# EAGLE design fuente_dual_power (EAGLE 9.4.2)
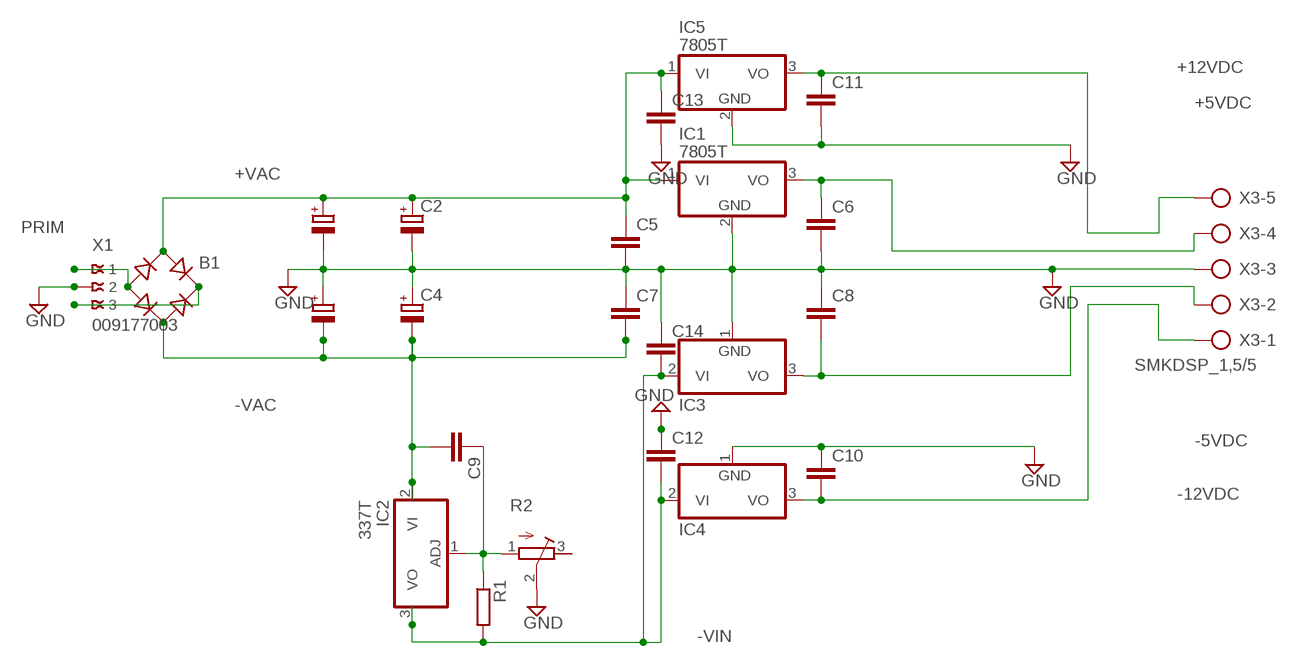
[diagram p0: schematic, sheet 1]

## Parts
B1  RB1A  [RB1A]
C2  CPOL-EUE1.8-4  [E1,8-4]
C4  CPOL-EUE1.8-4  [E1,8-4]
C5  C5/7.2  [C5B7.2]
C6  C5/7.2  [C5B7.2]
C7  C5/7.2  [C5B7.2]
C8  C5/7.2  [C5B7.2]
C9  C5/7.2  [C5B7.2]
C10  C5/7.2  [C5B7.2]
C11  C5/7.2  [C5B7.2]
C12  C5/7.2  [C5B7.2]
C13  C5/7.2  [C5B7.2]
C14  C5/7.2  [C5B7.2]
IC1  7805T  [TO220H]
IC2  337T  [TO220H]
IC3  7905T  [TO220H]
IC4  7905T  [TO220H]
IC5  7805T  [TO220H]
R1  R-EU_0204/5  [0204/5]
R2  R-TRIMM64W  [RTRIM64W]
X1  009177003  [009177003]
X3  SMKDSP_1,5/5  [SMKDSP_1,5/5]

## Nets
+5VDC: C6.1 IC1.3(VO) X3.4
+12VDC: C11.1 IC5.3(VO) X3.5
+VAC: B1.AC1 C2.+ C5.1 C13.1 IC1.1(VI) IC5.1(VI)
-5VDC: C8.2 IC3.3(VO) X3.2
-12VDC: C10.2 IC4.3(VO) X3.1
-VAC: B1.AC2 C4.- C7.2 C9.2 IC2.2(VI)
-VIN: C12.2 C14.2 IC2.3(VO) IC3.2(VI) IC4.2(VI) R1.2
ADJ: C9.1 IC2.1(ADJ) R1.1 R2.1(A)
GND: C2.- C4.+ C5.2 C6.2 C7.1 C8.1 C10.1 C11.2 C12.1 C13.2 C14.1 IC1.2(GND) IC3.1(GND) IC4.1(GND) IC5.2(GND) R2.2(S) X1.2 X3.3
PRIM: B1.- X1.1
SEC: B1.+ X1.3
Unconnected: R2.3(E)

## Library data of the parts
B1 = rectifier:RB1A: RECTIFIER 1 A
C2 C4 = rcl:CPOL-EU: POLARIZED CAPACITOR, European symbol; SPICEPREFIX: C
C5-C7 C9 C12-C14 = capacitor-wima:C: CAPACITOR naming: grid - package width
C8 C10 C11 = capacitor-wima:C: CAPACITOR naming: grid - package width; SPICEPREFIX: C
IC1 IC5 = linear:78*: Positive VOLTAGE REGULATOR Source: http://cache.national.com/ds/LM/LM78L05.pdf http://www.fairchildsemi.com/ds/LM/LM7805.pdf
IC2 = linear:*337: Negative VOLTAGE REGULATOR
IC3 IC4 = linear:79*: Negative VOLTAGE REGULATOR
R1 = rcl:R-EU_: RESISTOR, European symbol; SPICEPREFIX: R
R2 = rcl:R-TRIMM: Trimm resistor; SPICEMODEL: X; SPICEPREFIXL: POT
X1 = con-avx:00917?003: Wire to Board Strip IDC Connector 3 WAY Source: http://www.avx.com/docs/Catalogs/9176.pdf http://www.avx.com/docs/Catalogs/9177.pdf; MPN: 009177003001006; OC_FARNELL: unknown; OC_NEWARK: 09P1128
X3 = con-phoenix-smkdsp:SMKDSP_1,5/5: Printklemme, Nennstrom: 17,5 A, Bemessungsspannung: 250 V, Raster: 5,0 mm Source: http://eshop.phoenixcontact.de .. 1733415.pdf; OC_FARNELL: unknown; OC_NEWARK: unknown

## Board
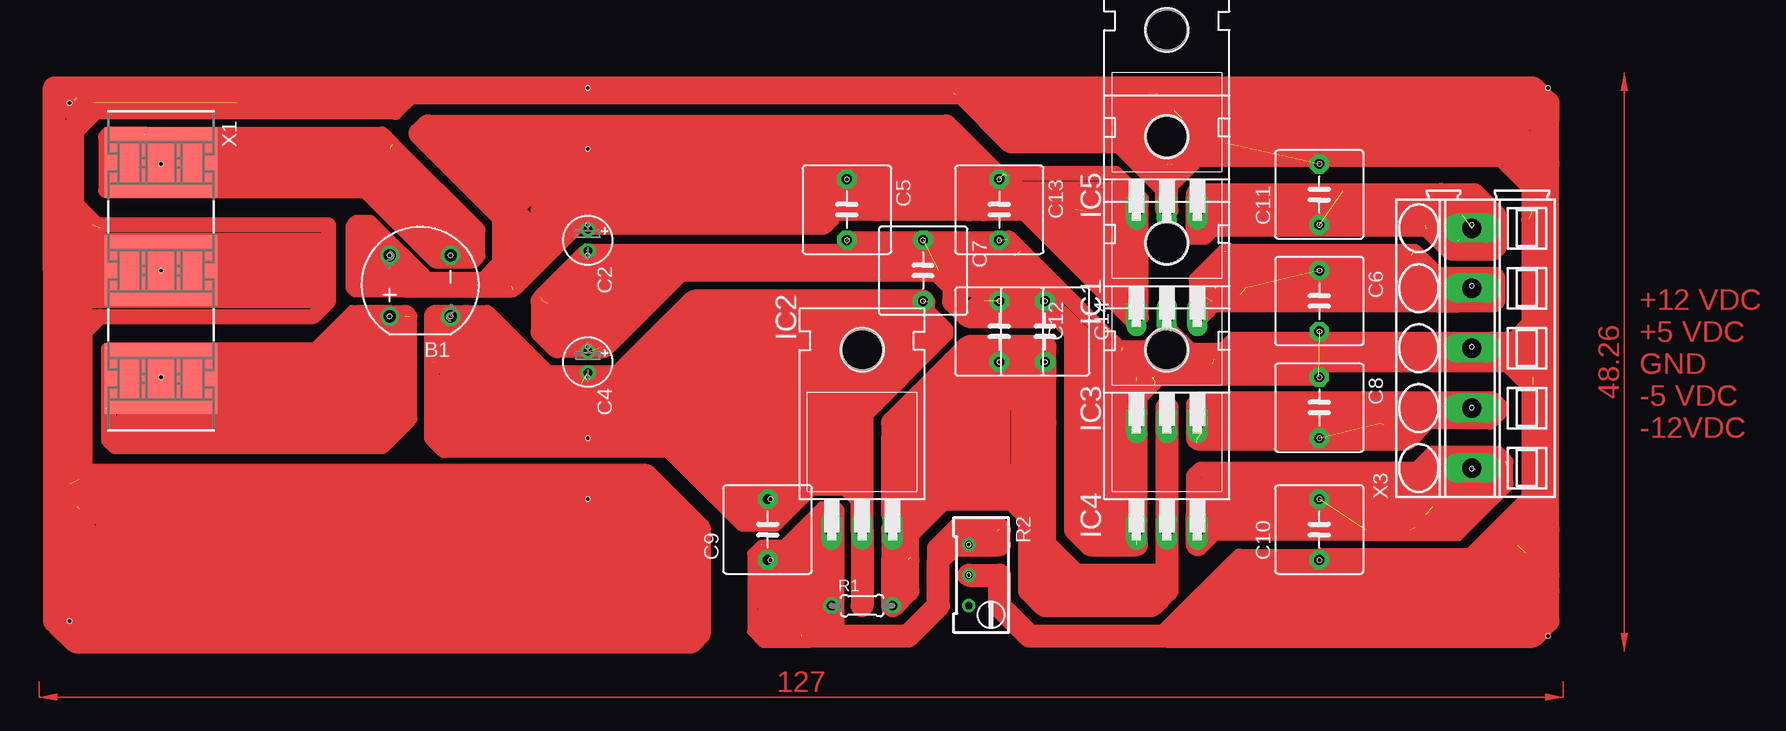
[diagram p1: board, top side]

No outline drawn. Coordinates in mm, seen from the top.
Copper layers (1*16): Top 0.035mm / dielectric 1.5mm / Bottom 0.035mm
Design rules "default": minimum track width 6mil, minimum drill 0.35mm, track to track 6mil, track to pad 6mil, pad to pad 6mil, via to via 6mil, smd to smd 6mil, copper to edge 40mil, drill to drill 6mil, minimum pad ring 10mil, minimum via ring 8mil, stop-mask expansion 4mil, vias tented up to drill 0mil, thermal gap 10mil
Holes 0.35 mm at 115.57,33.02 115.57,38.1 115.57,27.94 115.57,22.86 115.57,17.78 102.87,10.16 102.87,15.24 102.87,20.32 102.87,25.4 102.87,29.21 102.87,38.1 92.71,12.7 90.17,12.7 87.63,12.7 87.63,21.59 90.17,21.59 92.71,21.59 87.63,30.48 90.17,30.48 92.71,30.48 87.63,39.37 90.17,39.37 92.71,39.37 102.87,43.18 102.87,34.29 73.66,8.89 73.66,11.43 67.31,6.35 62.23,6.35 62.23,12.7 64.77,12.7 67.31,12.7 57.15,15.24 57.15,10.16 80.01,26.67 80.01,31.75 76.2,31.75 76.2,26.67 69.85,31.75 69.85,36.83 76.2,36.83 63.5,36.83 76.2,41.91 63.5,41.91 41.91,38.1 41.91,35.56 41.91,27.94 41.91,25.4 41.91,20.32 41.91,15.24 41.91,44.45 41.91,49.53 30.48,30.48 30.48,35.56 25.4,35.56 25.4,30.48 6.35,25.4 6.35,34.29 6.35,43.18 -1.27,5.08 -1.27,48.26 121.92,49.53 121.92,3.81

### Footprints (pad centres in the part's own frame; a part is rotated, then mirrored left to right if it is on the bottom)
RB1A = drill 1.016: + -2.54,2.54 | drill 1.016 octagon: - 2.54,-2.54; AC1 2.54,2.54; AC2 -2.54,-2.54
E1,8-4 = drill 0.711 pad 1.168: + -0.889,0 | drill 0.711 pad 1.168 octagon: - 0.889,0
C5B7.2 = drill 0.813 pad 1.6 octagon: 1 -2.54,0; 2 2.54,0
TO220H = drill 1.118 long: 1 -2.54,-10.16; 2 0,-10.16; 3 2.54,-10.16 | hole 3.302: 0,4.826
0204/5 = drill 0.813 octagon: 1 -2.54,0; 2 2.54,0
RTRIM64W = drill 0.61: 1 1.27,-2.54; 2 1.27,0; 3 1.27,2.54
009177003 = smd 5.9 x 9.4: 1 -9,0; 2 0,0; 3 9,0
SMKDSP_1,5/5 = drill 1.6 pad 1.8 long: 1 -2.5,0; 2 2.5,0; 3 7.5,0; 4 12.5,0; 5 17.5,0

### Placement (x,y rotation side)
B1  27.94,33.02 90 top
C2  41.91,36.83 270 top
C4  41.91,26.67 270 top
C5  63.5,39.37 270 top
C6  102.87,31.75 270 top
C7  69.85,34.29 270 top
C8  102.87,22.86 270 top
C9  56.9,12.7 90 top
C10  102.87,12.7 90 top
C11  102.87,40.64 90 top
C12  76.2,29.21 270 top
C13  76.2,39.37 270 top
C14  80.01,29.21 270 top
IC1  90.17,40.64 0 top
IC2  64.77,22.86 0 top
IC3  90.17,31.75 0 top
IC4  90.17,22.86 0 top
IC5  90.17,49.53 0 top
R1  64.77,6.35 0 top
R2  74.93,8.89 180 top
X1  6.35,34.29 270 top
X3  115.57,20.32 90 top

### Tracks (layer width: path | path; a pad name or v marks a point on that pad's centre or on a via)
+5VDC  (7 unrouted)
  Top 1.27: 111.71,33.98 117.53,33.98 117.73,33.78 117.73,31.7 117.45,31.42 94.23,31.42 93.93,31.73 | 95.07,35.92 110.8,35.92 112.45,34.27 96.01,34.27 95.96,34.31 96.52,34.87 110.52,34.87 | 95.71,35.79 95.58,35.92 94.97,35.92 92.61,33.55 92.61,29.97 94.87,32.23 96.01,32.23 | 96.24,32.23 96.01,32.23 | 96.01,32.23 95.28,32.97 94.31,32.97 93.37,32.03
  Top 1.905: 111.76,32.82 X3.4 115.57,33.02 | 111.76,32.82 96.72,32.82 96.52,33.02 | 94.18,32.82 93.98,33.02 95.89,34.92 | 110.49,35.56 113.03,33.02 | 111.76,32.82 112.83,31.75 114.3,31.75
+12VDC  (6 unrouted)
  Top 1.27: 114.58,36.83 113.03,36.83 111.76,38.1 | 92.73,40.72 92.33,40.31 92.33,37.08 93.34,37.08 94.13,37.87 | 110.39,38.25 110.87,37.77 111.78,37.77 113.79,35.76 117.45,35.76 | 117.81,36.12 117.81,38.91 116.53,38.91 115.44,40.01 114.58,40.01 112.85,38.28 114.38,36.75 116.97,36.75 114.78,38.94 114.78,39.04 | 104.85,40.95 115.88,40.95 117.81,39.01
  Top 1.905: IC5.3 93.98,38.1 111.76,38.1 | 113.03,40.64 92.71,40.64 IC5.3 | IC5.3 113.03,39.37
+VAC  (7 unrouted)
  Top 1.27: C2.+ 42.29,38.1 46.99,38.1 48.26,39.37 | 28.8,33.25 23.75,38.3 22.63,38.3 22.33,38 22.33,32.92 22.55,32.69 35.69,32.69 34.85,33.53 22.58,33.53 | 41.88,37.92 61.65,37.92 62.26,38.53 | 78.16,40.46 87.55,31.06 87.61,31.06 87.61,40.21 87.58,40.23 78.77,40.23 76.83,42.16 | 83.44,39.19 83.64,39.4 86.59,39.4 | 77.93,39.45 87.25,30.12 87.76,30.12 88.04,30.4 88.04,40.26 85.9,42.39 76.58,42.39 77.85,41.12 86.92,41.12
  Top 1.778: 26.04,34.92 27.94,33.02 29.21,33.02 33.02,33.02 34.92,34.92 35.56,35.56 36.83,36.83 37.47,37.47 38.1,38.1 38.1,39.37 38.1,41.91 38.1,44.45 39.37,45.72 43.18,45.72 48.26,45.72 49.53,45.72
  Top 1.905: C13.1 74.3,43.81 | 74.3,43.81 73.66,44.45 | 73.66,44.45 73.03,45.09 | 73.03,45.09 72.39,45.72 | 72.39,45.72 48.26,45.72 30.48,45.72 | C13.1 73.66,39.37 66.04,39.37 C5.1 60.96,44.45 44.45,44.45 43.18,45.72 | C13.1 78.74,39.37 | 82.55,35.56 82.55,38.1 | 82.55,38.1 82.55,39.37 78.74,39.37 | 86.58,38.1 83.82,38.1 83.82,35.56 82.55,35.56 | 78.74,39.37 49.53,39.37 45.72,43.18 | 38.1,38.1 40.64,38.1 38.1,35.56 | 34.92,34.92 34.92,38.73 | 34.92,38.73 38.1,41.91 | 35.56,35.56 38.1,35.56 | 38.1,35.56 35.56,33.02 29.21,33.02 26.67,33.02 26.04,33.66 26.04,34.92 25.4,34.29 22.86,34.29 22.86,36.83 24.13,36.83 24.77,36.2 | B1.AC1 24.77,36.2 | 24.77,36.2 24.13,35.56 | 72.39,45.72 71.75,46.35 28.57,46.35 27.94,45.72 31.75,41.91 | 34.92,38.73 32.38,41.27 | 32.38,41.27 31.75,41.91 | 30.48,45.72 30.48,44.45 | 73.03,45.09 31.11,45.09 | 31.11,45.09 30.48,45.72 | 31.11,45.09 31.75,44.45 73.66,44.45 | 74.3,43.81 73.66,43.18 31.75,43.18 31.75,41.91 | 32.38,41.27 75.56,41.27 | 75.56,41.27 C13.1 | C13.1 76.2,40.64 74.93,39.37 | 34.92,38.73 36.83,36.83 | 37.47,37.47 34.29,40.64 | 75.56,41.27 74.93,41.91 73.66,41.91 | 86.58,38.1 86.55,38.08 86.55,35.08 86.58,35.05 86.58,33.23 86.36,33.02 84.45,34.92 | 84.45,34.92 84.45,36.2 85.09,36.83 | 84.45,34.92 85.09,35.56 | 78.74,39.37 79.38,38.73 | 79.38,38.73 82.55,35.56 | 79.38,38.73 81.92,38.73 82.55,38.1 | 38.1,39.37 48.26,39.37 59.69,39.37 60.96,40.64 | 87.63,39.16 86.58,38.1
-5VDC  (4 unrouted)
  Top 1.27: 110.92,21.72 110.64,21.44 108.28,21.44 | 92.66,19.94 110.26,19.94 112.01,21.69 117.04,21.69 117.09,21.64 117.96,22.5 117.96,22.96 117.32,23.6 92.84,23.6 92.41,23.16 | 93.04,20.7 93.12,20.78 110.31,20.78
  Top 1.905: IC3.3 92.71,22.86 95.25,22.86 95.29,22.82 X3.2 | IC3.3 92.71,20.32 | IC3.3 107.95,21.59
-12VDC  (6 unrouted)
  Top 0.635: 110.45,12.7 113.03,12.7 113.67,13.34 | 113.67,13.34 116.84,16.51 116.84,16.55 | 111.11,13.36 113.64,13.36 113.67,13.34 | X3.1 116.84,16.55 | 116.84,16.55 115.61,16.55 115.57,16.51
  Top 0.813: 118.52,18.06 118.52,16.2 114.45,12.14 110.13,12.14 110.87,12.88 114.15,12.88 117.83,16.56 117.88,16.56 117.91,16.59 117.91,18.14 117.32,17.55 117.32,16.74
  Top 1.27: X3.1 115.57,16.51 113.03,13.97 | 111.76,13.97 95.25,13.97 | 115.85,17.7 92.89,17.7 92.38,17.2 92.38,11.43 93.52,12.57 93.52,16.61 93.83,16.92 108.97,16.92 107.92,15.88 94.13,15.88 | 118.42,16.54 118.42,18.36 117.73,19.05 112.34,19.05 111.15,17.86
  Top 1.905: 92.71,13.97 92.71,11.43 93.98,12.7 106.68,12.7 | X3.1 115.53,17.78 111.76,17.78 110.49,16.51 106.68,12.7 | X3.1 112.38,14.62 | 112.38,14.62 111.11,13.36 110.45,12.7 106.68,12.7 | 112.38,14.62 94.64,14.62 93.98,13.97 | X3.1 112.99,15.24 111.76,15.24 111.76,16.51 113.03,16.51
-VAC  (5 unrouted)
  Top 1.27: 51.79,19.28 29.92,19.28 28.91,20.3 28.91,26.72 33.02,26.72 39.42,20.32 30.1,20.32 30.07,20.34 30.07,25.27 32.84,25.27 32.92,25.35 37.11,21.16 | 37.11,21.16 37.39,21.16 | 37.11,21.16 31.11,21.16 30.91,21.36 30.91,24.23 32.72,24.23 32.74,24.26 35.15,21.84 | 35.15,21.84 35.31,21.84 | 35.15,21.84 31.98,21.84 31.77,22.05 31.77,23.16 33.17,23.16 33.58,22.76 33.43,22.61 32.61,22.61 | 48.44,19.51 54.79,13.16 57.53,13.16 60.63,16.26 60.63,16.41 59.74,16.41 57.15,13.82 54.86,13.82 54.79,13.89 | 29.72,27.18 29.72,30.12 30.4,30.81 33.53,30.81 38.61,25.73 | 64.69,21.92 71.75,28.98 71.75,29.36 70.26,30.86 | 70.26,30.86 70.26,31.7 | 70.26,30.86 70.26,29.36 70.61,29.01
  Top 1.778: 31.75,30.48 33.02,30.48 34.29,29.21 35.56,27.94
  Top 1.905: 36.83,26.67 35.56,27.94 | 38.1,25.4 34.29,29.21 34.29,27.94 31.75,27.94 31.11,28.57 | 38.1,22.86 38.1,25.4 | 66.81,30.77 66.27,31.3 56.71,31.3 | 66.81,30.77 68.39,29.18 68.39,26.19 | 66.81,30.77 C7.2 | 64.77,15.24 IC2.2 64.77,6.35 | 64.77,15.24 64.77,22.57 66.27,24.07 | 49.53,20.32 49.53,19.05 50.8,17.78 | 49.53,20.32 40.64,20.32 38.1,22.86 | C9.2 53.34,15.24 50.8,17.78 | 31.75,30.48 B1.AC2 29.21,30.48 29.21,26.67 30.48,26.67 | 30.48,26.67 34.29,26.67 38.1,22.86 | 63.5,16.51 64.77,15.24 | C9.2 57.66,16 | 57.66,16 58.17,16.51 59.69,16.51 | 59.69,16.51 63.5,16.51 | 59.69,16.51 58.42,15.24 C9.2 | 68.39,26.19 69.85,27.65 C7.2 | C7.2 50.8,31.75 50.16,31.11 | 39.37,25.4 44.45,25.4 46.99,27.94 | 39.37,25.4 38.1,25.4 | 50.16,31.11 47.62,28.57 | 47.62,28.57 46.99,27.94 | 39.37,25.4 39.37,22.86 40.64,21.59 63.5,21.59 63.5,22.86 41.91,22.86 40.64,24.13 41.27,24.77 41.97,24.07 66.27,24.07 | 66.27,24.07 68.39,26.19 | 49.53,20.32 63.5,20.32 63.5,19.05 50.8,19.05 50.8,17.78 | 50.8,17.78 63.5,17.78 63.5,16.51 | 57.66,16 53.85,16 45.72,24.13 45.72,25.4 61.94,25.4 | 61.94,25.4 62.08,25.25 | 61.94,25.4 60.67,26.67 46.99,26.67 46.99,27.94 | 47.62,28.57 60.33,28.57 60.96,27.94 61.15,28.13 61.15,29.18 62.34,30.37 62.23,30.48 60.96,30.48 | 60.96,30.48 59.69,29.21 49.53,29.21 | 50.16,31.11 60.33,31.11 60.96,30.48 | 30.48,26.67 31.11,27.3 29.84,28.57 30.48,29.21 31.11,28.57 | 31.11,28.57 31.75,29.21 33.02,29.21
  Top 2.54: 61.94,25.4 64.77,25.4 66.67,27.3 | 66.67,27.3 67.31,27.94 65.41,29.84 62.23,26.67 62.87,26.04 64.14,26.04 66.04,27.94 66.67,27.3 | 61.15,29.18 61.17,29.21 68.58,29.21
-VIN  (2 unrouted)
  Top 1.27: 79.15,12.93 77.22,14.86 71.53,14.86 68.83,12.17 68.83,10.39
  Top 1.905: IC2.3 67.31,10.16 | 67.31,10.16 68.58,10.16 | 68.58,12.7 68.58,13.97 67.31,13.97 67.31,20.32 | 67.31,20.32 69.85,22.86 72.28,24.32 | 72.28,24.32 C12.2 73.66,21.59 | 73.66,21.59 73.66,20.32 | 73.66,20.32 73.66,19.05 | 73.66,19.05 72.39,17.78 | 72.39,17.78 69.85,15.24 68.58,15.24 | 73.66,19.05 75.56,17.14 | 75.56,17.14 76.2,16.51 | 77.47,16.51 78.74,16.51 78.11,17.14 78.11,24.77 | 90.17,22.86 IC4.2 90.17,8.89 | 67.31,10.16 R1.2 68.58,7.62 68.58,10.16 | 90.17,8.89 90.17,7.62 88.9,6.35 80.01,6.35 78.74,7.62 78.74,10.16 | 78.74,10.16 78.74,15.24 77.47,16.51 | 77.47,16.51 76.2,16.51 | 90.17,8.89 82.55,8.89 | 82.55,8.89 80.01,8.89 | 82.55,8.89 80.01,11.43 80.01,21.59 | 80.01,21.59 80.01,25.4 | 80.01,25.4 78.74,26.67 74.93,26.67 | 72.39,26.67 67.31,21.59 67.31,20.32 | 74.93,26.67 72.39,26.67 | 68.58,10.16 68.58,12.7 | 68.58,12.7 71.12,15.24 | 71.12,15.24 72.39,16.51 | 72.39,16.51 76.2,16.51 | C14.2 80.01,25.4 | C14.2 78.11,24.77 | 78.74,27.94 78.11,27.3 78.11,24.77 | 76.2,27.94 74.93,26.67 | 78.74,27.94 76.2,27.94 | 76.2,27.94 73.66,27.94 72.39,26.67 | 75.56,17.14 75.56,24.77 76.2,25.4 80.01,21.59 | 77.47,16.51 76.2,17.78 76.2,22.86 73.66,22.86 | 73.66,22.86 73.66,21.59 | 73.66,19.05 73.66,17.78 72.39,17.78 | 72.28,24.32 72.47,24.13 73.66,24.13 73.66,22.86 | 73.66,22.86 72.39,22.86 68.58,19.05 68.58,16.51 72.39,16.51 | 73.66,20.32 71.12,17.78 69.85,17.78 69.85,19.05 72.39,21.59 | 78.74,10.16 80.01,8.89 | 80.01,8.89 80.01,7.62 88.9,7.62 | C14.2 80.01,27.94 78.74,27.94 | 71.12,15.24 77.47,15.24
ADJ  (4 unrouted)
  Top 0.813: 68.07,3.68 61.67,3.68 58.19,7.16 58.19,10.64 57.43,11.4 56.31,11.4 55.6,10.69 55.6,4.19 56.54,3.25 60.4,3.25 59.69,3.96 56.87,3.96 56.26,4.57 56.26,5.66 57.53,4.39 57.76,4.39 | 62.36,14.48 61.27,14.48 58.19,11.4 56.44,11.4 56.41,11.38 56.74,11.05 58.88,11.05 58.88,11.12 59.84,12.09 | 60.17,12.42 59.84,12.09 | 59.84,12.09 59.84,10.95 59.82,10.92 58.67,10.92 58.67,7.47 61.27,4.88 61.29,4.9 62.89,4.9 62.89,14.38 62.64,14.63 61.39,14.63 59.74,12.98 59.74,7.32 61.72,5.33 62.53,5.33 60.33,7.54 59.33,7.54 59.28,7.59 59.28,10.36
  Top 1.27: 76.02,12.57 75.56,13.03 72.64,13.03 70.79,11.18 70.79,6.86
  Top 1.905: IC2.1 R1.1 | C9.1 56.9,6.6 59.69,3.81 68.58,3.81 71.12,6.35 71.12,10.16 72.39,11.43 | R1.1 60.96,7.62 60.96,12.7 62.23,13.97 R1.1 | 73.66,12.7 R2.1 | 73.66,12.7 76.2,12.7 76.2,11.43 72.39,11.43 | 73.66,12.7 72.39,11.43
GND  (38 unrouted)
  Top 0.152: X1.2 7.62,34.29
  Top 0.61: 88.32,24.71 87.63,25.4
  Top 0.813: 87.99,23.57 89.13,24.71
  Top 1.27: 20.32,36.83 -0.64,36.83 0.64,38.1 20.32,38.1 20.32,31.75 | 20.32,31.75 -0.64,31.75 | -0.64,30.48 1.27,30.48 | 1.27,30.48 19.05,30.48 20.32,31.75 | -1.27,27.94 1.27,30.48 | X1.2 5.08,34.29 | -1.27,21.59 0,21.59 | 28.93,48.84 27.23,48.84 25.88,47.5 -1.25,47.5 -1.55,47.8 -0.84,48.51 25.48,48.51 | 1.27,37.85 -0.69,39.8 -0.69,45.92 0.76,47.37 0.76,48.31 -1.22,46.33 -1.22,38.05 -0.84,38.05 -0.38,38.51 | 95.48,27.61 86.41,27.61 76.99,37.03 76.89,36.93 63.65,36.93 | 37.95,31.34 37.95,32.08 41.78,35.92 78,35.92 80.97,32.94 80.97,31.52 | 38.61,31.52 42.04,34.95 48.46,34.95 42.77,29.26 39.98,29.26 44.98,34.27 46.33,34.27 42.01,29.95 | 89.15,25.09 89.66,25.6 | 89.1,25.48 88.06,26.52 | 87.91,26.67 88.06,26.52 | 88.06,26.52 93.95,26.52 | 88.09,42.88 89.74,41.22 89.79,41.22 | 87.81,23.65 90.6,26.44 118.54,26.44 120.19,24.79 120.65,24.79 119.46,25.98 119.46,26.59 93.19,26.59 90.53,29.26 | 86.49,27.86 88.54,27.86 90.14,29.46 90.14,28.52 90.35,28.32 | 89.97,3.81 89.97,4.24 96.19,10.46 117.81,10.46 120.47,7.8 94.23,7.8 94.13,7.7 | 90.19,39.32 90.19,41.1 92.69,43.59 118.95,43.59 119.96,44.6 | 120.98,45.62 119.96,44.6 | 119.96,44.6 93.09,44.6 | 93.09,44.6 91.14,42.65 | 93.09,44.6 93.42,44.93 95,44.93 | 117.6,43.97 120.32,41.25 | 120.32,41.25 120.32,38.58 | 120.32,41.25 120.32,42.82 120.42,42.93 120.02,43.33 119.84,43.33 | 120.57,30.15 118.97,28.55 95.76,28.55 94.08,26.87 | 102.79,25.45 102.64,25.3 88.98,25.3 | 90.25,40.64 81.86,49.02 | 81.86,49.02 80.75,49.02 | 81.86,49.02 89.38,49.02 90.78,47.62 90.6,47.45 90.6,43.23 89.05,43.23 84.73,47.55 | 84.18,48.11 84.73,47.55 | 84.73,47.55 89.38,47.55 89.38,44.3
  Top 1.27: 89.38,44.3 89.71,43.97 | 89.38,44.3 86.87,46.81 | 86.87,46.81 86.69,46.81 | 86.87,46.81 88.09,46.81 88.82,46.08 | 72.59,48.92 72.85,48.92 77.04,44.73 87.25,44.73 87.58,45.06 87.02,45.62 77.22,45.62 74.91,47.93 74.91,48.16 82.25,48.16 83.41,46.99 | 84.05,46.35 83.41,46.99 | 83.41,46.99 76.5,46.99 77.47,46.02 84.38,46.02
  Top 1.905: -0.57,33.02 5.08,33.02 X1.2 7.62,35.56 19.05,35.56 19.05,34.29 | 38.1,31.75 38.1,29.21 | 38.1,29.21 39.37,27.94 43.18,27.94 49.53,34.29 71.12,34.29 71.75,33.66 | 72.39,33.02 71.75,33.66 | 72.39,33.02 72.39,31.75 73.66,30.48 | 82.55,29.21 81.28,30.48 73.66,30.48 | 82.55,29.21 82.55,12.7 83.82,11.43 86.36,11.43 | 86.36,11.43 87.63,11.43 87.63,25.11 | 86.55,26.19 87.63,25.11 | 86.55,26.19 86.55,26.67 85.82,27.4 | 85.82,27.4 85.28,27.94 83.82,27.94 | 83.82,27.94 82.55,29.21 | 38.1,29.21 44.45,35.56 | 49.52,35.56 77.47,35.56 | 71.75,33.66 72.39,34.29 78.74,34.29 | 76.2,33.02 72.39,33.02 | 73.66,30.48 74.93,31.75 | 74.93,31.75 76.2,33.02 | 76.2,33.02 80.01,33.02 | C14.1 74.93,31.75 | 83.82,27.94 83.82,13.97 85.09,12.7 85.09,26.67 85.82,27.4 | 86.55,26.19 86.36,26 86.36,11.43 | 87.63,25.4 87,26.04 | 87.63,25.11 88.41,25.89 88.9,25.4 | 96.52,27.82 X3.3 120.53,27.82 120.65,27.94 | 120.65,25.4 120.65,27.94 | 120.65,27.94 120.65,29.21 | 120.65,39.37 120.65,24.79 120.65,15.24 116.2,10.79 | 116.2,10.79 115.57,10.16 C10.1 | R2.2 76.2,8.89 76.2,6.35 78.74,3.81 89.97,3.81 90.17,3.81 | 92.08,5.71 92.71,6.35 120.65,6.35 121.92,7.62 | 92.08,5.71 90.17,3.81 | 90.17,3.81 120.65,3.81 121.92,5.08 121.92,7.62 | 121.92,7.62 121.92,8.89 | 121.92,8.89 121.92,12.7 | 121.92,12.7 121.92,43.18 | 121.92,43.18 121.28,43.81 119.38,45.72 95.03,45.72 94.51,46.25 | 92.08,5.71 120.02,5.71 120.65,5.08 | 95.25,8.89 121.92,8.89 | 116.2,10.79 120.02,10.79 120.65,10.16 | 121.92,12.7 120.65,11.43 119.38,11.43 | 119.38,11.43 118.11,11.43 | 119.38,11.43 119.38,12.7 120.65,13.97 | -0.57,33.02 -1.27,33.02 | -2.54,34.29 -1.27,33.02 | 94.51,46.25 93.79,46.97 92.5,48.26
  Top 1.905: -2.54,34.29 -2.54,49.53 -1.27,49.53 | 26.67,49.09 72.39,49.09 75.75,49.09 88.67,49.09 91.67,49.09 92.5,48.26 | 26.67,49.09 25.62,48.04 | -0.57,33.02 -0.57,35.56 | 2.54,35.56 -0.57,35.56 | 121.92,48.26 120.65,49.53 26.23,49.53 | 121.92,43.18 121.92,46.99 | 121.92,48.26 121.92,46.99 | 121.92,48.26 92.5,48.26 | 94.51,46.25 95.25,46.99 121.92,46.99 | IC5.2 90.17,43.18 | 19.05,34.29 19.05,33.02 8.89,33.02 | 19.05,34.29 8.89,34.29 | -1.27,33.02 -1.27,31.75 -2.54,30.48 | -2.54,34.29 -2.54,30.48 | -2.54,30.48 -2.54,5.08 | -0.57,33.02 -1.27,32.32 -1.27,27.94 -1.27,21.59 -1.27,17.78 | -0.57,35.56 0.7,34.29 3.81,34.29 | -1.27,49.53 -0.57,48.83 | -1.27,49.53 26.23,49.53 | 26.23,49.53 26.67,49.09 | 12.92,48.04 12.7,48.26 | -0.64,15.88 -1.27,16.51
  Top 2.54: -1.27,11.43 -1.27,13.97 -0.64,14.61 -0.64,30.48 -0.64,31.75 -0.64,36.83 | -0.57,48.83 -0.64,48.77 | 91.47,46.97 92.71,45.72 91.63,44.64 | -1.7,13.39 -1.7,15.7 -0.48,16.92 46.63,16.92 50.93,12.62 50.93,4.17 50.39,3.63 -0.61,3.63 -2.03,5.05 -0.41,6.68 -0.41,14.43 46.41,14.43 48.84,11.99 48.84,5.54 48.44,5.13 48.03,5.54 0.89,5.54 1.96,6.6 1.96,12.39 45.01,12.39 46.56,10.85 46.56,7.49 46.08,7.01 4.5,7.01 3.5,8 3.5,10.19 44.04,10.19 44.86,9.37 43.81,8.33 4.98,8.33
N$1
  Top 1.27: 29.06,27.41 29.06,30.68 29.18,30.81
N$2
  Top 0.813: 112.06,12.98 112.75,12.98 112.8,13.03
N$3
  Top 1.27: 32,35.89 32,35.31 31.85,35.15
N$6
  Top 0.813: 73.76,8.51 73.38,8.89 73.15,8.66
N$14
  Top 0.813: 73.64,8.81 73.1,8.81
PRIM  (2 unrouted)
  Top 1.27: 9.86,41.55 10.44,40.97 23.37,40.97 29.23,35.1 32.33,35.1 32.74,35.51 32.74,37.69 26.01,44.42 | 26.01,44.42 25.65,44.78 | 25.65,44.78 25.63,44.78 | 4.62,45.29 5,45.67 24.77,45.67 25.65,44.78 | 26.01,44.42 24.61,43.03 10.77,43.03 | 5.44,45.14 4.9,45.67 1.96,45.67 1.73,45.44 1.73,40.97
  Top 1.905: B1.- 27.94,38.1 | 27.94,38.1 27.94,40.64 25.29,43.29 26.56,43.29 | 26.67,39.37 24.13,41.91 22.86,41.91 | 7.73,41.91 22.86,41.91 | 27.94,38.1 26.67,38.1 22.86,41.91 | B1.- 31.75,35.56 31.75,38.1 | 31.75,38.1 30.48,38.1 | 30.48,38.1 29.21,38.1 29.21,40.64 | 29.21,40.64 26.56,43.29 | 29.21,40.64 31.75,38.1 | B1.- 30.48,38.1 | X1.1 7.51,44.45 25.4,44.45 26.56,43.29
SEC  (3 unrouted)
  Top 0.813: 1.93,27.91 19.15,27.91 22.25,31.01 26.21,27.05 27.25,27.05 27.25,26.34 24.26,23.34 23.65,22.73 10.16,22.73 10.67,23.24 23.55,23.24 26.34,26.04 26.52,26.04 | 1.75,27.81 1.75,22.76 1.85,22.66
  Top 1.27: 2.16,23.22 1.96,23.01 1.96,20.17 2.52,19.61 24.77,19.61 27.08,21.92 27.08,30.48 26.04,29.44 26.04,22.43 24.38,20.78 2.82,20.78 2.82,21.51 3.3,22 24.11,22 25.48,23.37 25.48,23.57
  Top 1.905: B1.+ 24.13,29.21 | 24.13,29.21 22.86,27.94 22.86,26.67 | 22.86,26.67 22.86,25.4 22.75,25.29 X1.3 9,25.29 10.16,24.13 22.86,24.13 25.4,26.67 | B1.+ 26.67,30.48 26.67,29.21 | 26.67,29.21 26.67,26.67 25.4,26.67 | 25.4,26.67 22.86,26.67 | B1.+ 22.86,30.48 21.59,29.21 | 21.59,29.21 20.32,27.94 20.32,26.67 | 20.32,26.67 11.43,26.67 | 20.32,26.67 21.59,27.94 22.23,27.3 24.77,27.3 25.4,27.94 24.13,29.21 | 22.86,26.67 21.59,26.67 21.59,29.21 | 26.67,29.21 25.4,29.21
(copper drawn outside any net)
  shapes: Top area x2

### Text on the board
Top: +12 VDC / +5 VDC / GND / -5 VDC / -12VDC